# EAGLE design my_board (EAGLE 7.4.0)
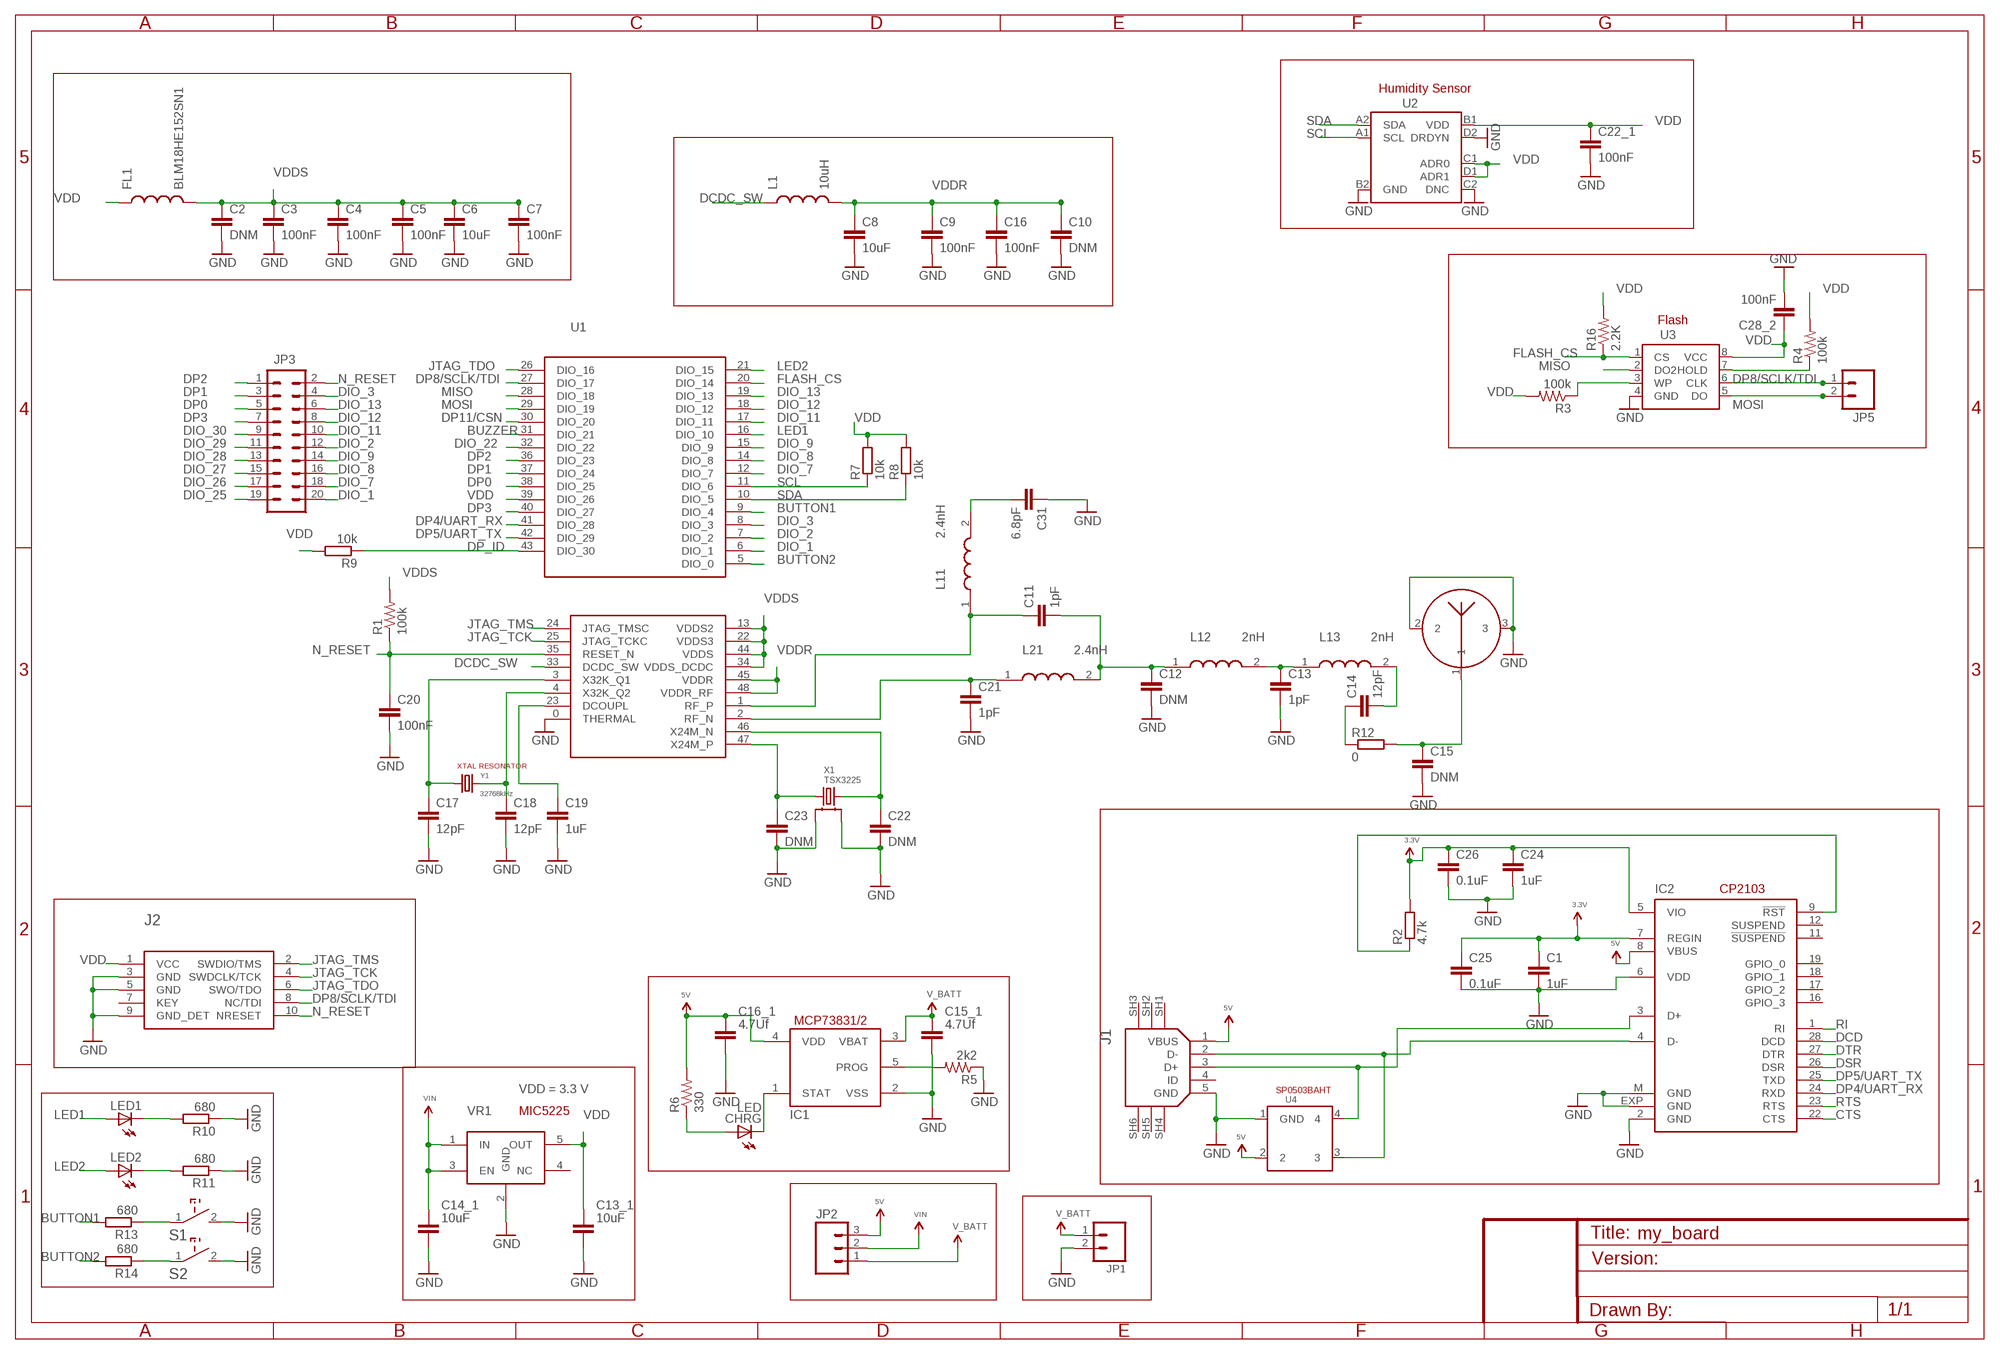
[diagram p0: schematic, sheet 1]

## Parts
C1  1uF  CAP0402-CAP  [0402-CAP]
C2  DNM  CAP0603-CAP  [0603-CAP]
C3  100nF  CAP0402-CAP  [0402-CAP]
C4  100nF  CAP0402-CAP  [0402-CAP]
C5  100nF  CAP0402-CAP  [0402-CAP]
C6  10uF  CAP0603-CAP  [0603-CAP]
C7  100nF  CAP0603-CAP  [0603-CAP]
C8  10uF  CAP0603-CAP  [0603-CAP]
C9  100nF  CAP0402-CAP  [0402-CAP]
C10  DNM  CAP0402-CAP  [0402-CAP]
C11  1pF  CAP0402-CAP  [0402-CAP]
C12  DNM  CAP0402-CAP  [0402-CAP]
C13  1pF  CAP0402-CAP  [0402-CAP]
C13_1  10uF  DP_DEVICES_CAPACITOR_NPOL-0603  [DP_DEVICES_C603]
C14  12pF  CAP0402-CAP  [0402-CAP]
C14_1  10uF  DP_DEVICES_CAPACITOR_NPOL-0603  [DP_DEVICES_C603]
C15  DNM  CAP0402-CAP  [0402-CAP]
C15_1  4.7Uf  DP_DEVICES_CAPACITOR_NPOL-0603  [DP_DEVICES_C603]
C16  100nF  CAP0402-CAP  [0402-CAP]
C16_1  4.7Uf  DP_DEVICES_CAPACITOR_NPOL-0603  [DP_DEVICES_C603]
C17  12pF  CAP0402-CAP  [0402-CAP]
C18  12pF  CAP0402-CAP  [0402-CAP]
C19  1uF  CAP0402-CAP  [0402-CAP]
C20  100nF  CAP0402-CAP  [0402-CAP]
C21  1pF  CAP0402-CAP  [0402-CAP]
C22  DNM  CAP0402-CAP  [0402-CAP]
C22_1  100nF  CAP0402-CAP  [0402-CAP]
C23  DNM  CAP0402-CAP  [0402-CAP]
C24  1uF  CAP0402-CAP  [0402-CAP]
C25  0.1uF  CAP0402-CAP  [0402-CAP]
C26  0.1uF  CAP0402-CAP  [0402-CAP]
C28_2  100nF  CAP0402-CAP  [0402-CAP]
C31  6.8pF  CAP0402-CAP  [0402-CAP]
CHRG  LED  DP_DEVICES_LED-0603  [DP_DEVICES_LED-603]
FL1  BLM18HE152SN1  INDUCTOR0603  [0603]
IC1  ADAFRUIT_MCP73831/OT  [ADAFRUIT_SOT23-5L]
IC2  CP2103_USB_UART  [MLP28]
J1  USB-1981568  [1981568-1]
J2  ARM-10PIN-JTAG  [ARM-10PIN-DEBUGGER]
JP1  SPARKFUN-CONNECTORS_M02PTH3  [SPARKFUN-CONNECTORS_1X02_LONGPADS]
JP2  M03-SCREW-5MM  [SCREWTERMINAL-5MM-3]
JP3  M10X2  [2X10]
JP5  M02PTH  [1X02]
L1  10uH  INDUCTOR0805  [0805]
L11  2.4nH  LQG15HS2N4S02D  [LQG15HS2N4S02D]
L12  2nH  LQG15HS2N4S02D  [LQG15HS2N4S02D]
L13  2nH  LQG15HS2N4S02D  [LQG15HS2N4S02D]
L21  2.4nH  LQG15HS2N4S02D  [LQG15HS2N4S02D]
LED1  DP_DEVICES_LED-0805  [DP_DEVICES_LED-805]
LED2  DP_DEVICES_LED-0805  [DP_DEVICES_LED-805]
R1  100k  RESISTOR0402-RES  [0402-RES]
R2  4.7k  R-EU_R0402  [R0402]
R3  100k  RESISTOR0402-RES  [0402-RES]
R4  100k  RESISTOR0402-RES  [0402-RES]
R5  2k2  SPARKFUN-RESISTORS_RESISTOR0805-RES  [SPARKFUN-RESISTORS_0805]
R6  330  SPARKFUN-RESISTORS_RESISTOR0805-RES  [SPARKFUN-RESISTORS_0805]
R7  10k  R-EU_R0402  [R0402]
R8  10k  R-EU_R0402  [R0402]
R9  10k  R-EU_R0402  [R0402]
R10  680  R-EU_R0402  [R0402]
R11  680  R-EU_R0402  [R0402]
R12  0  R-EU_R0402  [R0402]
R13  680  R-EU_R0402  [R0402]
R14  680  R-EU_R0402  [R0402]
R16  2.2K  RESISTOR0402-RES  [0402-RES]
S1  B3U-1000P-SWITCH  [B3U-1000P-SWITCH]
S2  B3U-1000P-SWITCH  [B3U-1000P-SWITCH]
U1  CC2650  [CC2650]
U2  HDC1000YPA  [HDC1000YPA]
U3  W25X40CLUXIGSS  [W25X40SSIG]
U4  SP0503BAHT  [SP0503BAHT]
U$1  PCB-ANTENNA  [PCB-ANTENNA]
VR1  USBUG_MIC5225-3.3YM5  [USBUG_SOT23-5]
X1  TSX3225  TSX-3225  [TSX-3225]
Y1  32768kHz  CRYSTAL_RESONATOR  [CRYSTAL_RESONATOR]

## Nets
3.3V: C1.1 C24.1 C25.1 C26.1 IC2.5(VIO) IC2.7(REGIN) R2.2
5V: C16_1.1 IC1.4(VDD) IC2.8(VBUS) J1.1(VBUS) JP2.3 R6.2 U4.2
BUTTON1: R13.2 U1.9(DIO_4)
BUTTON2: R14.2 U1.5(DIO_0)
BUZZER: U1.31(DIO_21)
CTS: IC2.22(CTS)
DCD: IC2.28(DCD)
DCDC_SW: L1.1 U1.33(DCDC_SW)
DIO_1: JP3.20 U1.6(DIO_1)
DIO_2: JP3.12 U1.7(DIO_2)
DIO_3: JP3.4 U1.8(DIO_3)
DIO_7: JP3.18 U1.12(DIO_7)
DIO_8: JP3.16 U1.14(DIO_8)
DIO_9: JP3.14 U1.15(DIO_9)
DIO_11: JP3.10 U1.17(DIO_11)
DIO_12: JP3.8 U1.18(DIO_12)
DIO_13: JP3.6 U1.19(DIO_13)
DIO_22: U1.32(DIO_22)
DIO_25: JP3.19
DIO_26: JP3.17
DIO_27: JP3.15
DIO_28: JP3.13
DIO_29: JP3.11
DIO_30: JP3.9
DP0: JP3.5 U1.38(DIO_25)
DP1: JP3.3 U1.37(DIO_24)
DP2: JP3.1 U1.36(DIO_23)
DP3: JP3.7 U1.40(DIO_27)
DP4/UART_RX: IC2.24(RXD) U1.41(DIO_28)
DP5/UART_TX: IC2.25(TXD) U1.42(DIO_29)
DP8/SCLK/TDI: J2.8(NC/TDI) JP5.1 U1.27(DIO_17) U3.6(CLK)
DP11/CSN: U1.30(DIO_20)
DP_ID: R9.1 U1.43(DIO_30)
DSR: IC2.26(DSR)
DTR: IC2.27(DTR)
FLASH_CS: R16.1 U1.20(DIO_14) U3.1(CS)
GND: C1.2 C2.2 C3.2 C4.2 C5.2 C6.2 C7.2 C8.2 C9.2 C10.2 C12.2 C13.2 C13_1.2 C14_1.2 C15.2 C15_1.2 C16.2 C16_1.2 C17.2 C18.2 C19.2 C20.2 C21.2 C22.2 C22_1.2 C23.2 C24.2 C25.2 C26.2 C28_2.2 C31.1 IC1.2(VSS) IC2.2(GND) IC2.6(VDD) IC2.EXP(GND) IC2.M(GND) J1.5(GND) J2.3(GND) J2.5(GND) J2.9(GND_DET) JP1.2 R5.1 R10.1 R11.1 S1.2 S2.2 U1.0(THERMAL) U2.B2(GND) U2.C2(DNC) U2.D2(DRDYN) U3.4(GND) U4.1(GND) U$1.2 U$1.3 VR1.2(GND) X1.2 X1.4
JTAG_TCK: J2.4(SWDCLK/TCK) U1.25(JTAG_TCKC)
JTAG_TDO: J2.6(SWO/TDO) U1.26(DIO_16)
JTAG_TMS: J2.2(SWDIO/TMS) U1.24(JTAG_TMSC)
LED1: LED1.A U1.16(DIO_10)
LED2: LED2.A U1.21(DIO_15)
MISO: U1.28(DIO_18) U3.2(DO2)
MOSI: JP5.2 U1.29(DIO_19) U3.5(DO)
N$1: C31.2 L11.2
N$2: C17.1 U1.3(X32K_Q1) Y1.P$1
N$3: C18.1 U1.4(X32K_Q2) Y1.P$4
N$4: C14.2 L13.2
N$5: C22.1 U1.46(X24M_N) X1.3
N$6: C11.2 C12.1 L12.1 L21.2
N$7: CHRG.A R6.1
N$8: C13.1 L12.2 L13.1
N$9: C14.1 R12.1
N$10: C15.1 R12.2 U$1.1
N$11: C23.1 U1.47(X24M_P) X1.1
N$12: CHRG.C IC1.1(STAT)
N$13: C11.1 L11.1 U1.1(RF_P)
N$14: C21.1 L21.1 U1.2(RF_N)
N$15: IC1.5(PROG) R5.2
N$16: C19.1 U1.23(DCOUPL)
N$17: LED1.C R10.2
N$18: R3.1 U3.3(WP)
N$19: R4.1 U3.7(HOLD)
N$20: IC2.3(D+) J1.3(D+) U4.4
N$21: IC2.4(D-) J1.2(D-) U4.3
N$22: LED2.C R11.2
N$24: IC2.9(!RST) R2.1
N$26: R13.1 S1.1
N$27: R14.1 S2.1
N_RESET: C20.1 J2.10(NRESET) JP3.2 R1.1 U1.35(RESET_N)
RI: IC2.1(RI)
RTS: IC2.23(RTS)
SCL: R7.1 U1.11(DIO_6) U2.A1(SCL)
SDA: R8.1 U1.10(DIO_5) U2.A2(SDA)
V_BATT: C15_1.1 IC1.3(VBAT) JP1.1 JP2.1
VDD: C13_1.1 C22_1.1 C28_2.1 FL1.1 J2.1(VCC) R3.2 R4.2 R7.2 R8.2 R9.2 R16.2 U1.39(DIO_26) U2.B1(VDD) U2.C1(ADR0) U2.D1(ADR1) U3.8(VCC) VR1.5(OUT)
VDDR: C8.1 C9.1 C10.1 C16.1 L1.2 U1.45(VDDR) U1.48(VDDR_RF)
VDDS: C2.1 C3.1 C4.1 C5.1 C6.1 C7.1 FL1.2 R1.2 U1.13(VDDS2) U1.22(VDDS3) U1.34(VDDS_DCDC) U1.44(VDDS)
VIN: C14_1.1 JP2.2 VR1.1(IN) VR1.3(EN)
Unconnected: IC2.11(!SUSPEND) IC2.12(SUSPEND) IC2.16(GPIO_3) IC2.17(GPIO_2) IC2.18(GPIO_1) IC2.19(GPIO_0) J1.4(ID) J1.SH1 J1.SH2 J1.SH3 J1.SH4 J1.SH5 J1.SH6 J2.7(KEY) VR1.4(NC)

## Notes on the sheet
- VDD = 3.3 V

## Library data of the parts
C1 C3-C5 C9-C22 C22_1 C23-C26 C28_2 C31 = SparkFun-Passives:CAP: Capacitor Standard 0603 ceramic capacitor, and 0.1" leaded capacitor.
C2 C6-C8 = SparkFun-Capacitors:CAP: Capacitor Standard 0603 ceramic capacitor, and 0.1" leaded capacitor.
C13_1 C14_1 C15_1 C16_1 = cc2538node:DP_DEVICES_CAPACITOR_NPOL: Non-Polarized capacitor in various packages
CHRG LED1 LED2 = cc2538node:DP_DEVICES_LED: Light Emitting Diode
FL1 L1 = SparkFun-Passives:INDUCTOR: Inductors Basic Inductor/Choke - 0603 and 1206. Footprints are not proven and vary greatly between part numbers. INDUCTOR POWER 3.3UH 4.0A SMD 0.197" L x 0.197" W x 0.177" H (5.00mm x 5.00mm x 4.50mm)
IC1 = cc2538node:ADAFRUIT_MCP73831: MCP73831/2 Miniature Single-Cell, Fully Integrated Li-Ion, Li-Polymer Charge Management Controllers. Nice and small simple lipoly charge controller, with adjustable current and status output (LED) http://www.ladyada.net/library/pcb/eaglelibrary.html
IC2 = SparkFun-DigitalIC:CP2103_USB_UART: Single-Chip USB to UART Bridge Source: www.silabs.com .. CP2103.pdf. Spark Fun Electronics SKU : COM-00309
J1 = 6lowpan:USB-1981568
J2 = 6lowpan:ARM-10PIN-JTAG: ARM 2x5 pin 1.27 mm pitch Jtag connector
JP1 = cc2538node:SPARKFUN-CONNECTORS_M02: Standard 2-pin 0.1" header. Use with - straight break away headers ( PRT-00116) - right angle break away headers (PRT-00553) - swiss pins (PRT-00743) - machine pins (PRT-00117) - female headers (PRT-00115) Molex polarized connector foot print use with: PRT-08233 with associated crimp pins and housings. 2.54_SCREWTERM for use with PRT-10571. 3.5mm Screw Terminal footprints for PRT-08084 5mm Screw Terminal footprints for use with PRT-08433
JP2 = SparkFun-Connectors:M03: Header 3 Standard 3-pin 0.1" header. Use with straight break away headers (SKU : PRT-00116), right angle break away headers (PRT-00553), swiss pins (PRT-00743), machine pins (PRT-00117), and female headers (PRT-00115). Molex polarized connector foot print use with SKU : PRT-08232 with associated crimp pins and housings.; STOREFRONT_ID: PRT-08433
JP3 = SparkFun-Connectors:M10X2: This was SPECIALLY designed to be used with our Graphic LCD Backpack. Be sure you want to use this! It is not only staggered on each line of header holes, but IT IS ALSO offset of the center point of the top and bottom lines by 5 mil. This causes the headers to lock into place on the "standard" footprint on the LCD screen. The extra squares on the tdocu layer are there simply to reference other pins (if you were to actually populate a longer header than ten long - this is what we do with the backpacks).
JP5 = SparkFun-Connectors:M02: Standard 2-pin 0.1" header. Use with - straight break away headers ( PRT-00116) - right angle break away headers (PRT-00553) - swiss pins (PRT-00743) - machine pins (PRT-00117) - female headers (PRT-00115) Molex polarized connector foot print use with: PRT-08233 with associated crimp pins and housings. 2.54_SCREWTERM for use with PRT-10571. 3.5mm Screw Terminal footprints for PRT-08084 5mm Screw Terminal footprints for use with PRT-08432
L11-L13 L21 = sensortag:LQG15HS2N4S02D: FIXED IND 2.4NH 300MA 150 MOHM - RF bobin Technical Specifications: Inductance: 2.4nH Operating Temperature: -55°C ~ 125°C Tolerance:±0.3nH Package / Case :0402 Frequency - Self Resonant: 6GHz Digikey: 490-8389-1-ND Manufacturer Part Numberr:LQG15HS2N4S02D
R1 R3 R4 R16 = SparkFun-Passives:RESISTOR: Resistor Basic schematic elements and footprints for 0603, 1206, and PTH resistors.
R2 R7-R14 = rcl:R-EU_: RESISTOR, European symbol
R5 R6 = cc2538node:SPARKFUN-RESISTORS_RESISTOR: Resistor Basic schematic elements and footprints for 0603, 1206, and PTH resistors.
S1 S2 = 6lowpan:B3U-1000P-SWITCH: B3U-1000P - Ultra-small Tactile Switch (SMT) Technical Specifications: High Contact Reliability Operating Temperature: -25°C to 70°C Contact Resistance: 100mOhm maxx Bounce Time: 5ms Max Digikey: SW1020CT-ND
U1 = sensortag:CC2650
U2 = sensortag:HDC1000YPA: HDC1000 -Humidity Sensor Technical Specifications: Supply Voltage 3 V to 5 V Operating -20°C to 85°C 200nA Sleep Mode Current I2C Interface Digikey: 296-38027-1-ND
U3 = sensortag:W25X40CLUXIG: ISSI serial flash -Flash Memory Technical Specifications: VCC: 2.3-3.6V Operating Temperature: -40°C to 105°C Memory size 4Mbit , speed 100MHz Max clock freq 100MHz , Manufacturer Part : IS25LD040-JBLE Mouser: 870-IS25LD040-JBLEP
U4 = sensortag:SP0503BAHT
U$1 = sensortag:PCB-ANTENNA
VR1 = cc2538node:USBUG_MIC5225: Ultra-Low Quiescent Current 150mA µCap Low Dropout Regulator; VOLTAGE: 3.3V
X1 = sensortag:TSX-3225: TSX-3225 -Crystal OSC. Technical Specifications: Frequency: 24MHz Frequency Tolerance: ±10ppm Load Capacitance:9pF Package / Case:4-SMD, No Lead (DFN, LCC) Operating Temperature:-40°C ~ 85°C Digikey: SER3635CT-ND Manufacturer Part Number:TSX-3225 24.0000MF15X-AC3
Y1 = sensortag:CRYSTAL_RESONATOR: CMR200T -CRYSTAL RESONATOR Technical Specifications: Nominal Frequency: 32.768kHz Operating Temperature: -40°C to 85°C Frequency Tolerance : +/-20ppm Motional (series) resistance: 50Kohm max Digikey: 300-8736-1-ND Manufacturer Part Number:CMR200T32768DZYT

## Board
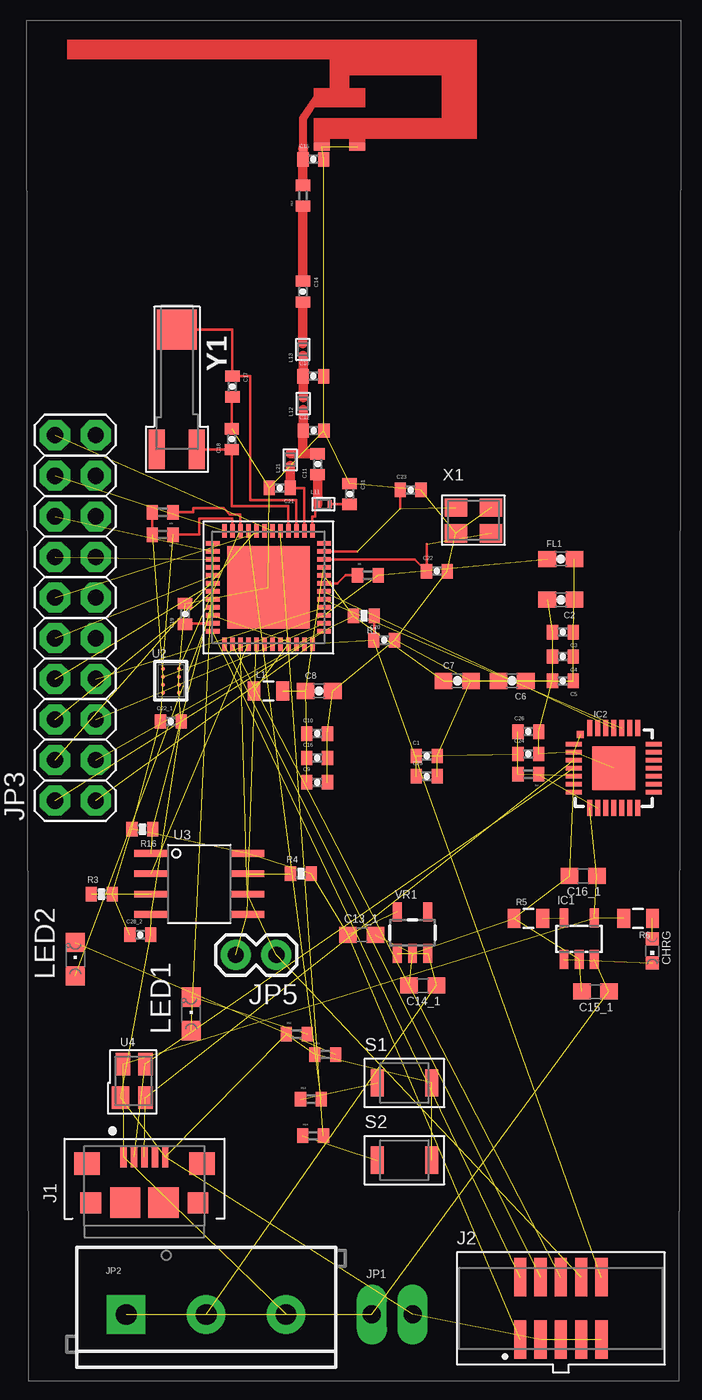
[diagram p1: board, top side]

No outline drawn. Coordinates in mm, seen from the top.
Copper layers (1*16): Top 0.035mm / dielectric 1.5mm / Bottom 0.035mm
Design rules "SparkFun": minimum track width 8mil, minimum drill 20mil, track to track 8mil, track to pad 8mil, pad to pad 8mil, via to via 8mil, smd to smd 8mil, copper to edge 8mil, drill to drill 8mil, minimum pad ring 12mil, minimum via ring 10mil, stop-mask expansion 4mil, vias tented up to drill 20mil, thermal gap 10mil

### Footprints (pad centres in the part's own frame; a part is rotated, then mirrored left to right if it is on the bottom)
0402-CAP = smd 0.7 x 0.9: 1 -0.65,0; 2 0.65,0
0603-CAP = smd 1.1 x 1: 1 -0.85,0; 2 0.85,0
DP_DEVICES_C603 = smd 1.1 x 1: 1 -0.85,0; 2 0.85,0
DP_DEVICES_LED-603 = smd 0.8 x 0.8: A 0,-0.75; C 0,0.75
0603 = smd 1.1 x 1: 1 -0.85,0; 2 0.85,0
ADAFRUIT_SOT23-5L = smd 0.55 x 1.2: 1 -0.95,-1.3; 2 0,-1.3; 3 0.95,-1.3; 4 0.95,1.3; 5 -0.95,1.3
MLP28 = smd 1 x 0.3: 1 -2.5,1.5; 2 -2.5,1; 3 -2.5,0.5; 4 -2.5,0; 5 -2.5,-0.5; 6 -2.5,-1; 7 -2.5,-1.5; 15 2.5,-1.5; 16 2.5,-1; 17 2.5,-0.5; 18 2.5,0; 19 2.5,0.5; 20 2.5,1; 21 2.5,1.5 | smd 0.3 x 1: 8 -1.5,-2.5; 9 -1,-2.5; 10 -0.5,-2.5; 11 0,-2.5; 12 0.5,-2.5; 13 1,-2.5; 14 1.5,-2.5; 22 1.5,2.5; 23 1,2.5; 24 0.5,2.5; 25 0,2.5; 26 -0.5,2.5; 27 -1,2.5; 28 -1.5,2.5 | smd 2.7 x 2.7: EXP 0,0 | smd 0.435 x 0.435: M -2.103,2.103
1981568-1 = smd 0.4 x 1.35: 1 -1.3,2.875; 2 -0.65,2.875; 3 0,2.875; 4 0.65,2.875; 5 1.3,2.875 | smd 1.6 x 1.4: SH1 -3.6,2.45; SH2 3.6,2.45 | smd 1.3 x 1.3: SH3 -3.35,0; SH6 3.35,0 | smd 1.9 x 1.9: SH4 -1.2,0; SH5 1.2,0
ARM-10PIN-DEBUGGER = smd 0.76 x 2.4: 1 -2.54,-1.95; 2 -2.54,1.95; 3 -1.27,-1.95; 4 -1.27,1.95; 5 0,-1.95; 6 0,1.95; 7 1.27,-1.95; 8 1.27,1.95; 9 2.54,-1.95; 10 2.54,1.95
SPARKFUN-CONNECTORS_1X02_LONGPADS = drill 1.118 pad 1.88 long: 1 0,0; 2 2.54,0
SCREWTERMINAL-5MM-3 = drill 1.3 pad 2.413 square: 1 0,0 | drill 1.3 pad 2.413: 2 5,0; 3 10,0
2X10 = drill 1.016 pad 1.88 octagon: 1 -11.43,-1.27; 2 -11.43,1.27; 3 -8.89,-1.27; 4 -8.89,1.27; 5 -6.35,-1.27; 6 -6.35,1.27; 7 -3.81,-1.27; 8 -3.81,1.27; 9 -1.27,-1.27; 10 -1.27,1.27; 11 1.27,-1.27; 12 1.27,1.27; 13 3.81,-1.27; 14 3.81,1.27; 15 6.35,-1.27; 16 6.35,1.27; 17 8.89,-1.27; 18 8.89,1.27; 19 11.43,-1.27; 20 11.43,1.27
1X02 = drill 1.016 pad 1.88: 1 0,0; 2 2.54,0
0805 = smd 0.8 x 1.2: 1 -0.9,0; 2 0.9,0
LQG15HS2N4S02D = smd 0.25 x 0.5: 1 -0.375,0; 2 0.375,0
DP_DEVICES_LED-805 = smd 1.2 x 1.2: A 0,-1.05; C 0,1.05
0402-RES = smd 0.7 x 0.9: 1 -0.65,0; 2 0.65,0
R0402 = smd 0.7 x 0.9: 1 -0.65,0; 2 0.65,0
SPARKFUN-RESISTORS_0805 = smd 0.8 x 1.2: 1 -0.9,0; 2 0.9,0
B3U-1000P-SWITCH = smd 0.8 x 1.7: 1 -1.7,0; 2 1.7,0
CC2650 = smd 5.15 x 5.15: 0 0,0 | smd 0.28 x 0.85: 1 -2.75,-3.55; 2 -2.25,-3.55; 3 -1.75,-3.55; 4 -1.25,-3.55; 5 -0.75,-3.55; 6 -0.25,-3.55; 7 0.25,-3.55; 8 0.75,-3.55; 9 1.25,-3.55; 10 1.75,-3.55; 11 2.25,-3.55; 12 2.75,-3.55; 25 2.75,3.55; 26 2.25,3.55; 27 1.75,3.55; 28 1.25,3.55; 29 0.75,3.55; 30 0.25,3.55; 31 -0.25,3.55; 32 -0.75,3.55; 33 -1.25,3.55; 34 -1.75,3.55; 35 -2.25,3.55; 36 -2.75,3.55 | smd 0.85 x 0.28: 13 3.475,-2.75; 14 3.475,-2.25; 15 3.475,-1.75; 16 3.475,-1.25; 17 3.475,-0.75; 18 3.475,-0.25; 19 3.475,0.25; 20 3.475,0.75; 21 3.475,1.25; 22 3.475,1.75; 23 3.475,2.25; 24 3.475,2.75; 37 -3.475,2.75; 38 -3.475,2.25; 39 -3.475,1.75; 40 -3.475,1.25; 41 -3.475,0.75; 42 -3.475,0.25; 43 -3.475,-0.25; 44 -3.475,-0.75; 45 -3.475,-1.25; 46 -3.475,-1.75; 47 -3.475,-2.25; 48 -3.475,-2.75
HDC1000YPA = smd 0.263 x 0.263: A1 -0.5,0.75; A2 0.5,0.75; B1 -0.5,0.25; B2 0.5,0.25; C1 -0.5,-0.25; C2 0.5,-0.25; D1 -0.5,-0.75; D2 0.5,-0.75
W25X40SSIG = smd 2.1 x 0.42: 1 -3,3.81; 2 -3,2.54; 3 -3,1.27; 4 -3,0; 5 3,0; 6 3,1.27; 7 3,2.54; 8 3,3.81
SP0503BAHT = smd 1.1 x 1.4: 1 -0.85,-1.05 | smd 0.9 x 1.4: 2 -0.7,1.05; 3 0.7,1.05; 4 0.7,-1.05
PCB-ANTENNA = smd 0.46 x 0.23: 1 -2.28,-0.625 | smd 1 x 0.5: 2 -1.1,-0.49; 3 1.1,-0.49
USBUG_SOT23-5 = smd 0.55 x 1.2: 1 -0.95,-1.3; 2 0,-1.3; 3 0.95,-1.3; 4 0.95,1.3; 5 -0.95,1.3
TSX-3225 = smd 1.4 x 1.15: 1 -1.1,0.8; 2 1.1,0.8; 3 1.1,-0.8; 4 -1.1,-0.8
CRYSTAL_RESONATOR = smd 2.5 x 2.5: P$1 -7.5,0 | smd 2.5 x 1: P$4 0,1.25; P$5 0,-1.25

### Placement (x,y rotation side)
C1  27.56,42.42 0 top
C2  35.94,52.2 180 top
C3  36.07,50.16 180 top
C4  36.07,48.64 180 top
C5  36.07,47.12 180 top
C6  32.89,47.12 180 top
C7  29.46,47.12 0 top
C8  20.83,46.48 0 top
C9  20.7,40.77 0 top
C10  20.7,43.81 0 top
C11  20.74,60.67 90 top
C12  20.48,62.77 0 top
C13  20.47,66.17 0 top
C13_1  23.5,31.24 0 top
C14  19.82,71.46 270 top
C14_1  27.3,28.07 180 top
C15  20.47,79.73 0 top
C15_1  38.1,27.69 180 top
C16  20.7,42.29 0 top
C16_1  37.34,34.92 180 top
C17  15.4,65.52 270 top
C18  15.37,62.23 90 top
C19  12.45,51.31 90 top
C20  24.89,49.66 0 top
C21  18.36,59.18 180 top
C22  28.19,53.98 0 top
C22_1  11.56,44.58 0 top
C23  26.54,59.05 0 top
C24  33.91,42.55 0 top
C25  27.56,41.15 0 top
C26  33.91,43.94 0 top
C28_2  9.65,31.24 0 top
C31  22.73,58.8 270 top
CHRG  41.66,30.23 180 top
FL1  35.94,54.74 0 top
IC1  37.08,30.99 0 top
IC2  39.24,41.66 0 top
J1  9.91,14.48 0 top
J2  35.94,7.87 0 top
JP1  24.13,7.49 0 top
JP2  8.76,7.49 0 top
JP3  5.59,51.05 90 top
JP5  18.16,29.97 180 top
L1  17.65,46.48 0 top
L11  21.11,58.17 0 top
L12  19.82,64.47 90 top
L13  19.81,67.85 90 top
L21  19.02,60.94 90 top
LED1  12.83,26.29 0 top
LED2  5.59,29.72 0 top
R1  23.62,51.18 180 top
R2  33.91,41.27 180 top
R3  7.24,33.78 0 top
R4  19.68,35.05 0 top
R5  33.91,32.26 0 top
R6  40.77,32.26 180 top
R7  11.05,56.26 180 top
R8  11.05,57.66 180 top
R9  23.88,53.72 0 top
R10  19.43,25.02 0 top
R11  21.21,23.75 0 top
R12  19.82,77.45 90 top
R13  20.32,20.95 0 top
R14  20.45,18.67 0 top
R16  9.78,37.85 180 top
S1  26.16,21.97 0 top
S2  26.16,17.14 0 top
U1  17.65,52.96 180 top
U2  11.56,47.12 0 top
U3  13.34,32.51 0 top
U4  9.27,22.1 0 top
U$1  22.1,81.03 0 top
VR1  26.67,31.37 0 top
X1  30.48,57.15 0 top
Y1  11.94,61.59 270 top

### Tracks (layer width: path | path; a pad name or v marks a point on that pad's centre or on a via)
3.3V  (6 unrouted)
5V  (6 unrouted)
BUTTON1  (1 unrouted)
BUTTON2  (1 unrouted)
DCDC_SW  (1 unrouted)
DIO_1  (1 unrouted)
DIO_2  (1 unrouted)
DIO_3  (1 unrouted)
DIO_7  (1 unrouted)
DIO_8  (1 unrouted)
DIO_9  (1 unrouted)
DIO_11  (1 unrouted)
DIO_12  (1 unrouted)
DIO_13  (1 unrouted)
DP0  (1 unrouted)
DP1  (1 unrouted)
DP2  (1 unrouted)
DP3  (1 unrouted)
DP4/UART_RX  (1 unrouted)
DP5/UART_TX  (1 unrouted)
DP8/SCLK/TDI  (3 unrouted)
DP_ID
  Top 0.142: R9.1 22.48,53.72 21.97,53.21 U1.43
FLASH_CS  (2 unrouted)
GND  (55 unrouted)
  Top 0.142: C17.2 15.37,64.87 C18.2
JTAG_TCK  (1 unrouted)
JTAG_TDO  (1 unrouted)
JTAG_TMS  (1 unrouted)
LED1  (1 unrouted)
LED2  (1 unrouted)
MISO  (1 unrouted)
MOSI  (2 unrouted)
N$1
  Top 0.142: L11.2 22.73,58.17 C31.2
N$2
  Top 0.142: Y1.P$1 15.4,69.09 C17.1 16.51,66.17 16.51,58.42 19.4,58.42 U1.3
N$3
  Top 0.142: Y1.P$4 C18.1 15.37,58.04 18.9,58.04 U1.4
N$4
  Top 0.597: C14.2 L13.2
N$5  (1 unrouted)
  Top 0.142: 27.54,55.69 C22.1 26.81,54.71 U1.46
N$6
  Top 0.597: L12.1 C12.1 19.81,62.77 19.81,61.32 | 19.81,61.32 L21.2 | 19.81,61.32 C11.2
N$7  (1 unrouted)
N$8
  Top 0.597: L13.1 19.82,67.47 C13.1 L12.2
N$9
  Top 0.597: R12.1 | R12.1 C14.1
N$10
  Top 0.597: U$1.1 C15.1 R12.2
N$11  (2 unrouted)
  Top 0.142: C23.1 25.89,57.89 | U1.47 23.21,55.21
N$12  (1 unrouted)
N$13
  Top 0.142: L11.1 20.57,58.17 20.57,57.4 20.4,57.4 U1.1
  Top 0.597: C11.1 L11.1
N$14
  Top 0.142: C21.1 19.9,59.18 U1.2
  Top 0.597: C21.1 L21.1
N$15  (1 unrouted)
N$16
  Top 0.142: U1.23 12.5,50.71 C19.1
N$17  (1 unrouted)
N$18  (1 unrouted)
N$19  (1 unrouted)
N$20  (2 unrouted)
N$21  (2 unrouted)
N$22  (1 unrouted)
N$24  (1 unrouted)
N$26  (1 unrouted)
N$27  (1 unrouted)
N_RESET  (3 unrouted)
  Top 0.142: R1.1 24.27,49.69 C20.1
SCL  (1 unrouted)
  Top 0.142: R7.1 13.34,56.26 13.34,57.28 15.4,57.28 U1.11
SDA  (1 unrouted)
  Top 0.142: U1.10 15.9,57.53 15.24,57.53 14.86,57.91 12.95,57.91 12.95,57.66 R8.1
V_BATT  (3 unrouted)
VDD  (15 unrouted)
  Top 0.142: R8.2 R7.2
VDDR  (6 unrouted)
VDDS  (11 unrouted)
VIN  (3 unrouted)